# Altium schematic sheet [05] NFC.SchDoc: NFC
size A3; Author: Caner ALP; Organization: ALP Electronics; Address1: Axel Oxenstiernas; Address2: Västerås; Address3: 72478; Address4: Sweden; DocumentNumber: 6; SheetNumber: 6; SheetTotal: 7
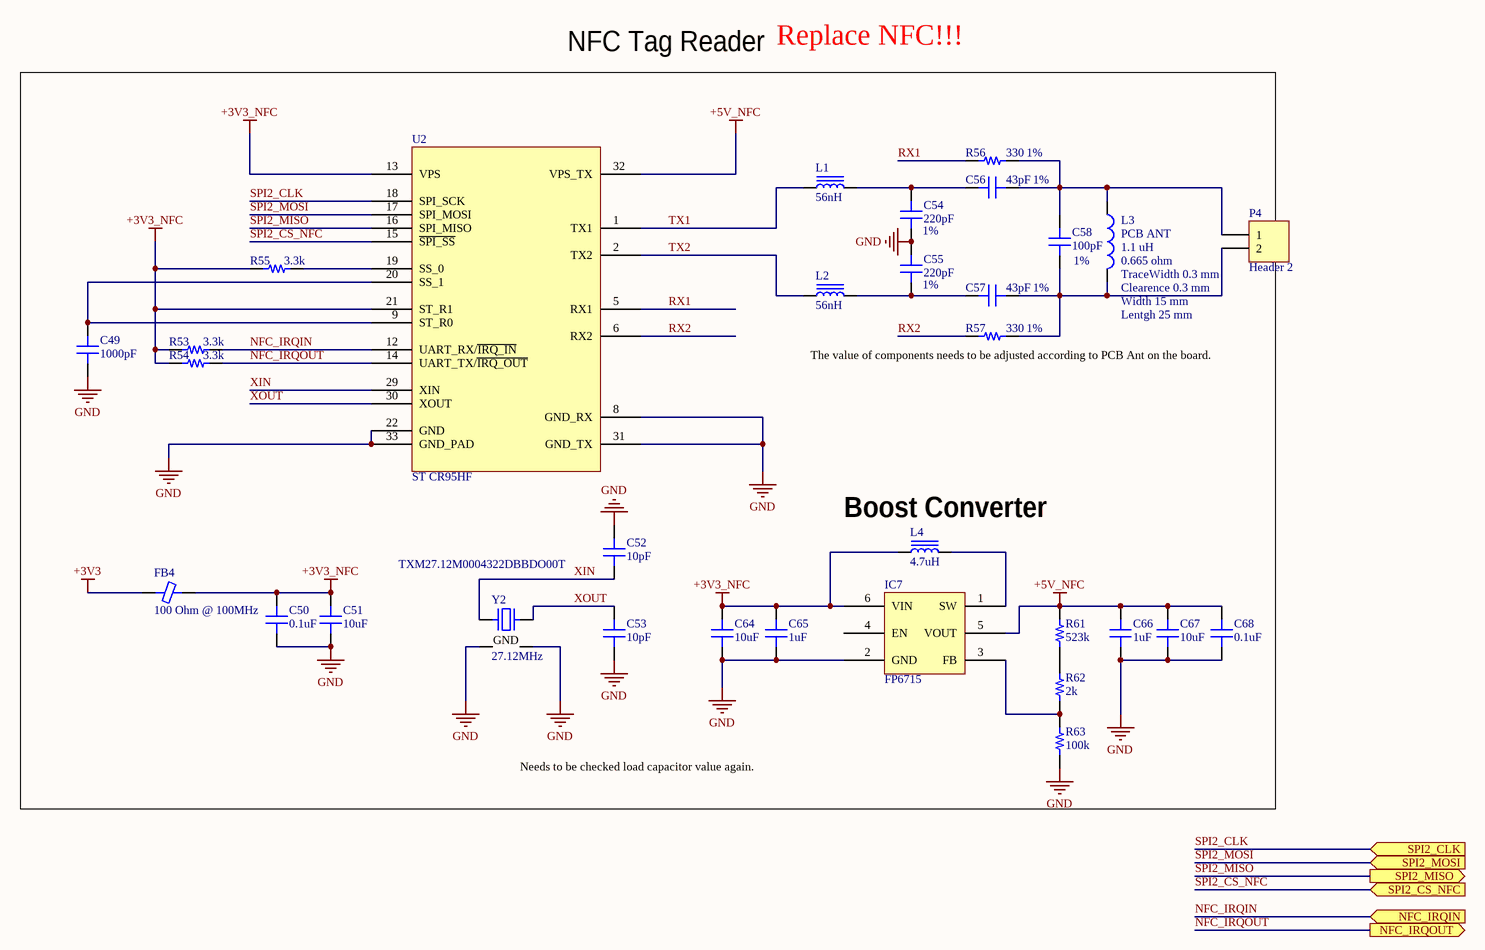
[diagram p0: [05] NFC.SchDoc]

## Parts
C49  1000pF  [CAP 0402/1005]
C50  0.1uF  [CAP 0402/1005]
C51  10uF  [CAP 0603/1608]
C52  10pF  [CAP 0402/1005]
C53  10pF  [CAP 0402/1005]
C54  220pF  Tolerance: 1%  [CAP 0402/1005]
C55  220pF  Tolerance: 1%  [CAP 0402/1005]
C56  43pF  Tolerance: 1%  [CAP 0402/1005]
C57  43pF  Tolerance: 1%  [CAP 0402/1005]
C58  100pF  Tolerance: 1%  [CAP 0402/1005]
C64  10uF  [CAP 0603/1608]
C65  1uF  [CAP 0603/1608]
C66  1uF  [CAP 0603/1608]
C67  10uF  [CAP 0603/1608]
C68  0.1uF  [CAP 0402/1005]
FB4  100 Ohm @ 100MHz  [FER 0603/1608]
IC7  FP6715  [ATMEL SOT-23-6 6ST1]
L1  56nH  [IND 0402/1005 RF WW]
L2  56nH  [IND 0402/1005 RF WW]
L3  PCB ANT  L_ANT: 1.1 uH  R_ANT: 0.665 ohm  TraceWidth: TraceWidth 0.3 mm  Clearence: Clearence 0.3 mm  Width: Width 15 mm  Length: Lentgh 25 mm  [0402-A]
L4  4.7uH  [TDK SPM3012]
P4  Header 2  [HDR1X2]
R53  3.3k  [RES 0402/1005]
R54  3.3k  [RES 0402/1005]
R55  3.3k  [RES 0402/1005]
R56  330  Tolerance: 1%  [RES 0402/1005]
R57  330  Tolerance: 1%  [RES 0402/1005]
R61  523k  [RES 0402/1005]
R62  2k  [RES 0402/1005]
R63  100k  [RES 0402/1005]
U2  ST CR95HF  [ST VFQFPN-32]
Y2  27.12MHz  Part Number: TXM27.12M0004322DBBDO00T  [NDK NX3225SA]

## Ports
NFC_IRQIN (in), NFC_IRQOUT (out), SPI2_CLK (in), SPI2_CS_NFC (in), SPI2_MISO (out), SPI2_MOSI (in)

## Nets
+3V3: FB4.1
+3V3_NFC: C50.2 C51.2 C64.2 C65.2 FB4.2 IC7.6(VIN) L4.1 R53.1 R54.1 R55.1 U2.13(VPS) U2.21(ST_R1)
+5V_NFC: C66.2 C67.2 C68.2 IC7.5(VOUT) R61.2 U2.32(VPS_TX)
GND: C49.1 C50.1 C51.1 C52.2 C53.1 C54.1 C55.2 C64.1 C65.1 C66.1 C67.1 C68.1 IC7.2(GND) R63.1 U2.8(GND_RX) U2.22(GND) U2.31(GND_TX) U2.33(GND_PAD) Y2.2(GND) Y2.4(GND)
NFC_IRQIN: R53.2 U2.12(UART_RX/~{IRQ_IN}) ; port NFC_IRQIN
NFC_IRQOUT: R54.2 U2.14(UART_TX/~{IRQ_OUT}) ; port NFC_IRQOUT
RX1: R56.1 U2.5(RX1)
RX2: R57.1 U2.6(RX2)
SPI2_CLK: U2.18(SPI_SCK) ; port SPI2_CLK
SPI2_CS_NFC: U2.15(~{SPI_SS}) ; port SPI2_CS_NFC
SPI2_MISO: U2.16(SPI_MISO) ; port SPI2_MISO
SPI2_MOSI: U2.17(SPI_MOSI) ; port SPI2_MOSI
TX1: L1.1 U2.1(TX1)
TX2: L2.1 U2.2(TX2)
XIN: C52.1 U2.29(XIN) Y2.1
XOUT: C53.2 U2.30(XOUT) Y2.3
NetC49_2: C49.2 U2.9(ST_R0) U2.20(SS_1)
NetC54_2: C54.2 C56.1 L1.2
NetC55_1: C55.1 C57.1 L2.2
NetC56_2: C56.2 C58.2 L3.1 P4.1 R56.2
NetC57_2: C57.2 C58.1 L3.2 P4.2 R57.2
NetIC7_1: IC7.1(SW) L4.2
NetIC7_3: IC7.3(FB) R62.1 R63.2
NetR55_2: R55.2 U2.19(SS_0)
NetR61_1: R61.1 R62.2

Not connected (* = marked no-connect by the designer): IC7 4(EN); U2 3(NC) 4(NC) 7(NC) 10(NC) 11(NC) 23(NC) 24(NC) 25(NC) 26(NC) 27(NC) 28(NC)

## Notes on the sheet
- NFC Tag Reader
- Replace NFC!!!
- (near R57) The value of components needs to be adjusted according to PCB Ant on the board.
- (near L4) Boost Converter
- Needs to be checked load capacitor value again.
- Title
- Size:
- Project
- A3
- Revision:
- Date:
- Sheet
- of

## Library data of the parts
C49 = C0402C102K9RACTU: CAP CER 1000PF 6.3V X7R 0402; Manufacturer: Kemet; TemperatureRange: -55C ~ 125C; Tolerance: 10%; Value: 1000pF; Part Number: C0402C102K9RACTU; PartId: 12782; Supplier 1: Digi-Key; Supplier Part Number 1: 399-8941-2-ND; ComponentLink1Description: Datasheet; ComponentLink1URL: http://www.kemet.com/docfinder?Partnumber=C0402C102K9RACTU; ComponentLink2Description: Digi-Key Listing; ComponentLink2URL: https://www.digikey.com/product-detail/en/kemet/C0402C102K9RACTU/399-8941-2-ND/2196206; TemperatureCoefficient: X7R; Voltage: 6.3V; Price: 0,0029; Device Package: 0402 (1005 Metric)
C50 C68 = C1005X7R1A104K050BB: CAP CER 0.1UF 10V X7R 0402; Manufacturer: TDK Corporation; TemperatureRange: -55C ~ 125C; Tolerance: 10%; Value: 0.1uF; Part Number: C1005X7R1A104K050BB; PartId: 3900; Supplier 1: Digi-Key; Supplier Part Number 1: 445-4958-2-ND; ComponentLink1Description: Datasheet; ComponentLink1URL: https://product.tdk.com/info/en/catalog/datasheets/mlcc_commercial_general_en.pdf; ComponentLink2Description: Digi-Key listing; ComponentLink2URL: http://digikey.com/product-detail/en/C1005X7R1A104K050BB/445-4958-2-ND/2093226; TemperatureCoefficient: X7R; Voltage: 10V; Price: 0,0066; Type: -; Device Package: 0402 (1005 Metric)
C51 C67 = C1608X5R1A106M080AC: CAP CER 10UF 10V X5R 0603; Manufacturer: TDK Corporation; TemperatureRange: -55C ~ 85C; Tolerance: 20%; Value: 10uF; Part Number: C1608X5R1A106M080AC; PartId: 13099; Supplier 1: Digi-Key; Supplier Part Number 1: 445-6853-2-ND; ComponentLink1Description: Datasheet; ComponentLink1URL: https://product.tdk.com/info/en/catalog/datasheets/mlcc_commercial_general_en.pdf; ComponentLink2Description: Digi-Key Listing; ComponentLink2URL: https://www.digikey.com/product-detail/en/tdk-corporation/C1608X5R1A106M080AC/445-6853-2-ND/2619194; TemperatureCoefficient: X5R; Voltage: 10V; Price: 0,0935; Device Package: 0603 (1608 Metric)
C52 C53 = C0402C100C8GACTU: CAP CER 10PF 10V NP0 0402; Manufacturer: Kemet; TemperatureRange: -55C ~ 125C; TemperatureCoefficient: C0G, NP0; Tolerance: 0.25pF; Value: 10pF; Part Number: C0402C100C8GACTU; PartId: 12811; Supplier 1: Digi-Key; Supplier Part Number 1: 399-8939-2-ND; ComponentLink1Description: Datasheet; ComponentLink1URL: http://www.kemet.com/docfinder?Partnumber=C0402C100C8GACTU; ComponentLink2Description: Digi-Key Listing; ComponentLink2URL: https://www.digikey.com/product-detail/en/kemet/C0402C100C8GACTU/399-8939-2-ND/2196146; Voltage: 10V; Price: 0,0523; Device Package: 0402 (1005 Metric)
C54 C55 = C1005C0G1H221F050BA: CAP CER 220PF 50V C0G 0402; Manufacturer: TDK Corporation; TemperatureRange: -55C ~ 125C; TemperatureCoefficient: C0G, NP0; Value: 220pF; Part Number: C1005C0G1H221F050BA; PartId: 3869; Supplier 1: Digi-Key; Supplier Part Number 1: 445-7015-2-ND; ComponentLink1Description: Datasheet; ComponentLink1URL: https://product.tdk.com/info/en/catalog/datasheets/mlcc_commercial_general_en.pdf; ComponentLink2Description: Digi-Key listing; ComponentLink2URL: http://digikey.com/product-detail/en/C1005C0G1H221F050BA/445-7015-2-ND/2674817; Voltage: 50V; Price: 0,1606; Type: -; Device Package: 0402 (1005 Metric)
C56 C57 = GRM1555C1H430GA01D: CAP CER 43PF 50V NP0 0402; Manufacturer: Murata Electronics North America; TemperatureRange: -55C ~ 125C; TemperatureCoefficient: C0G, NP0; Value: 43pF; Part Number: GRM1555C1H430GA01D; PartId: 5184; Supplier 1: Digi-Key; Supplier Part Number 1: 490-9664-2-ND; ComponentLink1Description: Datasheet; ComponentLink1URL: http://www.murata.com/~/media/webrenewal/support/library/catalog/products/capacitor/mlcc/c02e.ashx; ComponentLink2Description: Digi-Key listing; ComponentLink2URL: http://digikey.com/product-detail/en/GRM1555C1H430GA01D/490-9664-2-ND/3693990; Voltage: 50V; Price: 0,0202; Type: -; Device Package: 0402 (1005 Metric)
C58 = C1005C0G1H101F050BA: CAP CER 100PF 50V C0G 0402; Manufacturer: TDK Corporation; TemperatureRange: -55C ~ 125C; TemperatureCoefficient: C0G, NP0; Value: 100pF; Part Number: C1005C0G1H101F050BA; PartId: 3866; Supplier 1: Digi-Key; Supplier Part Number 1: 445-5362-2-ND; ComponentLink1Description: Datasheet; ComponentLink1URL: https://product.tdk.com/info/en/catalog/datasheets/mlcc_commercial_general_en.pdf; ComponentLink2Description: Digi-Key listing; ComponentLink2URL: http://digikey.com/product-detail/en/C1005C0G1H101F050BA/445-5362-2-ND/2269856; Voltage: 50V; Price: 0,1262; Type: -; Device Package: 0402 (1005 Metric)
C64 = C1608X5R1A106K080AC: CAP CER 10UF 10V X5R 0603; Manufacturer: TDK Corporation; TemperatureRange: -55C ~ 85C; Tolerance: 10%; Value: 10uF; Part Number: C1608X5R1A106K080AC; PartId: 13435; Supplier 1: Digi-Key; Supplier Part Number 1: 445-7486-2-ND; ComponentLink1Description: Datasheet; ComponentLink1URL: https://product.tdk.com/info/en/catalog/datasheets/mlcc_commercial_general_en.pdf; ComponentLink2Description: Digi-Key Listing; ComponentLink2URL: https://www.digikey.com/product-detail/en/tdk-corporation/C1608X5R1A106K080AC/445-7486-2-ND/2732921; TemperatureCoefficient: X5R; Voltage: 10V; Price: 0,102; Device Package: 0603 (1608 Metric)
C65 C66 = C0603C105K3RACTU: CAP CER 1UF 25V X7R 0603; Manufacturer: Kemet; TemperatureRange: -55C ~ 125C; Tolerance: 10%; Value: 1uF; Part Number: C0603C105K3RACTU; PartId: 13359; Supplier 1: Digi-Key; Supplier Part Number 1: 399-7376-2-ND; ComponentLink1Description: Datasheet; ComponentLink1URL: http://www.kemet.com/docfinder?Partnumber=C0603C105K3RACTU; ComponentLink2Description: Digi-Key Listing; ComponentLink2URL: https://www.digikey.com/product-detail/en/kemet/C0603C105K3RACTU/399-7376-2-ND/3317582; TemperatureCoefficient: X7R; Voltage: 25V; Price: 0,044; Device Package: 0603 (1608 Metric)
FB4 = BKP1608HS101-T: FERRITE CHIP 100 OHM 0603; Manufacturer: Taiyo Yuden; Type: Differential Mode - Single; DC Resistance: 50 mOhm Max; Current Rating: 1.7A; Part Number: BKP1608HS101-T; PartId: 6594; Value: 100 Ohm @ 100MHz; Supplier 1: Digi-Key; Supplier Part Number 1: 587-1922-2-ND; ComponentLink1Description: Datasheet; ComponentLink1URL: http://ds.yuden.co.jp/TYCOMPAS/ut/detail.do?productNo=BKP1608HS101-T&fileName=BKP1608HS101-T_SS&mode=specSheetDownload; ComponentLink2Description: Digi-Key listing; ComponentLink2URL: http://digikey.com/product-detail/en/BKP1608HS101-T/587-1922-2-ND/957775; Price: 0,0247; Device Package: 0603 (1608 Metric)
IC7 = FP6715: 550KHz High Efficiency Low Ripple Synchronous Step-Up Converter
L1 L2 = LQW15AN56NG00D: FIXED IND 56NH 200MA 1.17 OHM; Manufacturer: Murata Electronics North America; TemperatureRange: -55C ~ 125C; Tolerance: 2%; Type: Wirewound; Q at Frequency: 25 @ 200MHz; DC Resistance: 1.17 Ohm Max; Shielding: Unshielded; Value: 56nH; Part Number: LQW15AN56NG00D; PartId: 6404; Supplier 1: Digi-Key; Supplier Part Number 1: 490-6830-2-ND; ComponentLink1Description: Datasheet; ComponentLink1URL: http://search.murata.co.jp/Ceramy/image/img/PDF/ENG/L0075S0080LQW15A_00.pdf; ComponentLink2Description: Digi-Key listing; ComponentLink2URL: http://digikey.com/product-detail/en/LQW15AN56NG00D/490-6830-2-ND/2594932; Price: 0,0807; Device Package: 0402 (1005 Metric)
L3 = Inductor: Code_IEC: 1005; Value: 10mH; Published: 8-Jun-2000; LatestRevisionDate: 29-May-2009; LatestRevisionNote: IPC-7351 Footprint Added.; PackageReference: 0402-A; Publisher: Altium Limited; PackageDescription: Chip Inductor; Code_JEITA: 0402
L4 = SPM3012T-4R7M: FIXED IND 4.7UH 1.3A 270 MOHM; Manufacturer: TDK Corporation; Type: Wirewound; Tolerance: 20%; Shielding: Shielded; DC Resistance (DCR): 270 mOhm Max; Value: 4.7uH; Part Number: SPM3012T-4R7M; PartId: 9592; Supplier 1: Digi-Key; Supplier Part Number 1: 445-8932-2-ND; ComponentLink1Description: Datasheet; ComponentLink1URL: https://product.tdk.com/info/en/catalog/datasheets/inductor_commercial_power_spm3012_en.pdf; ComponentLink2Description: Digi-Key Listing; ComponentLink2URL: https://www.digikey.com/product-detail/en/SPM3012T-4R7M/445-8932-2-ND/3641271; Price: 0.616; Device Package: Nonstandard; Series: SPM; Inductance: 4.7uH; Current Rating: 1.3A; Q @ Freq: -; Frequency - Self Resonant: -; Operating Temperature: -40C ~ 125C
P4 = Header 2: Header, 2-Pin; LatestRevisionDate: 17-Jul-2002; LatestRevisionNote: Re-released for DXP Platform.; Publisher: Altium Limited
R53-R55 = RC0402JR-073K3L: RES SMD 3.3K OHM 5% 1/16W 0402; Manufacturer: Yageo; TemperatureRange: -55C ~ 155C; TemperatureCoefficient: 100ppm/C; PowerRating: 0.063W, 1/16W; Value: 3.3k; Part Number: RC0402JR-073K3L; PartId: 14533; Supplier 1: Digi-Key; Supplier Part Number 1: 311-3.3KJRTR-ND; ComponentLink1Description: Datasheet; ComponentLink1URL: http://www.yageo.com/documents/recent/PYu-RC_Group_51_RoHS_L_04.pdf; ComponentLink2Description: Digi-Key Listing; ComponentLink2URL: https://www.digikey.com/product-detail/en/yageo/RC0402JR-073K3L/311-3.3KJRTR-ND/726456; Tolerance: 5%; Price: 0,0017; Device Package: 0402 (1005 Metric)
R56 R57 = ERJ-2RKF3300X: RES SMD 330 OHM 1% 1/10W 0402; Manufacturer: Panasonic Electronic Components; TemperatureRange: -55C ~ 155C; TemperatureCoefficient: 100ppm/C; PowerRating: 0.1W, 1/10W; Value: 330; Part Number: ERJ-2RKF3300X; PartId: 165; Supplier 1: Digi-Key; Supplier Part Number 1: P330LTR-ND; ComponentLink1Description: Datasheet; ComponentLink1URL: http://industrial.panasonic.com/www-cgi/jvcr13pz.cgi?E+PZ+3+AOA0002+ERJ2RKF3300X+7+WW; ComponentLink2Description: Digikey listing; ComponentLink2URL: http://digikey.com/product-detail/en/ERJ-2RKF3300X/P330LTR-ND/1746189; Price: 0,0043; Type: Thick Film; Device Package: 0402 (1005 Metric)
R61 = ERJ-2RKF5233X: RES SMD 523K OHM 1% 1/10W 0402; Manufacturer: Panasonic Electronic Components; TemperatureRange: -55C ~ 155C; TemperatureCoefficient: 100ppm/C; PowerRating: 0.1W, 1/10W; Value: 523k; Part Number: ERJ-2RKF5233X; PartId: 461; Supplier 1: Digi-Key; Supplier Part Number 1: P523KLTR-ND; ComponentLink1Description: Datasheet; ComponentLink1URL: http://industrial.panasonic.com/www-cgi/jvcr13pz.cgi?E+PZ+3+AOA0002+ERJ2RKF5233X+7+WW; ComponentLink2Description: Digikey listing; ComponentLink2URL: http://digikey.com/product-detail/en/ERJ-2RKF5233X/P523KLTR-ND/192400; Tolerance: 1%; Price: 0,0043; Type: Thick Film; Device Package: 0402 (1005 Metric)
R62 = ERJ-2GEJ202X: RES SMD 2K OHM 5% 1/10W 0402; Manufacturer: Panasonic Electronic Components; TemperatureRange: -55C ~ 155C; TemperatureCoefficient: 200ppm/C; PowerRating: 0.1W, 1/10W; Value: 2k; Part Number: ERJ-2GEJ202X; PartId: 11049; Supplier 1: Digi-Key; Supplier Part Number 1: P2.0KJTR-ND; ComponentLink1Description: Datasheet; ComponentLink1URL: http://industrial.panasonic.com/www-cgi/jvcr13pz.cgi?E+PZ+3+AOA0001+ERJ2GEJ202X+7+WW; ComponentLink2Description: Digi-Key Listing; ComponentLink2URL: https://www.digikey.com/product-detail/en/panasonic-electronic-components/ERJ-2GEJ202X/P2.0KJTR-ND/146958; Tolerance: 5%; Price: 0,0019; Device Package: 0402 (1005 Metric)
R63 = ERJ-2RKF1003X: RES SMD 100K OHM 1% 1/10W 0402; Manufacturer: Panasonic Electronic Components; TemperatureRange: -55C ~ 155C; TemperatureCoefficient: 100ppm/C; PowerRating: 0.1W, 1/10W; Value: 100k; Part Number: ERJ-2RKF1003X; PartId: 2; Supplier 1: Digi-Key; Supplier Part Number 1: P100KLTR-ND; ComponentLink1Description: Datasheet; ComponentLink1URL: http://industrial.panasonic.com/www-cgi/jvcr13pz.cgi?E+PZ+3+AOA0002+ERJ2RKF1003X+7+WW; ComponentLink2Description: Digikey listing; ComponentLink2URL: http://digikey.com/product-detail/en/ERJ-2RKF1003X/P100KLTR-ND/192081; Tolerance: 1%; Price: 0,0043; Type: Thick Film; Device Package: 0402 (1005 Metric)
Y2 = NX3225SA-27.12M-STD-CSR-3: CRYSTAL 27.1200MHZ 8PF SMD; Manufacturer: NDK; Frequency Stability: 10ppm; Load Capacitance: 10pF; ESR: 30 Ohm; Operating Mode: Fundamental; PartId: 8523; Supplier 1: Digi-Key; Supplier Part Number 1: 644-1237-2-ND; ComponentLink1Description: Datasheet; ComponentLink1URL: http://www.ndk.com/images/products/catalog/c_NX3225SA-STD-CSR-3_e.pdf; ComponentLink2Description: Digi-Key Listing; ComponentLink2URL: http://www.digikey.com/product-detail/en/NX3225SA-27.12M-STD-CSR-3/644-1237-2-ND/4914451; Price: 0,3842; Type: MHz Crystal; Device Package: 4-SMD, No Lead (DFN, LCC); Frequency: 27.12MHz; Frequency Tolerance: 10ppm